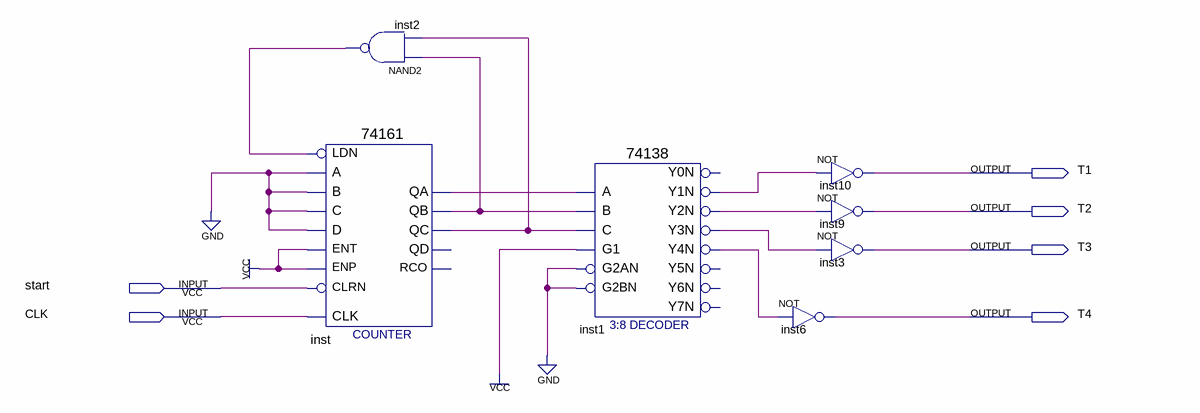
[diagram p0: schematic sheet]
// Quartus schematic MyTime.bdf as structural Verilog: 7 symbols, 6 pins
module MyTime (
  input  start,
  input  CLK,
  output T1,
  output T2,
  output T3,
  output T4
);

  wire inst1_y1n, inst1_y2n, inst1_y3n, inst1_y4n, inst2_out, inst_qa, inst_qb, inst_qc;

  \74161  inst (
    .CLRN(start), .CLK(CLK), .ENP(1'b1), .LDN(inst2_out), .A(1'b0), .D(1'b0), .ENT(1'b1), .B(1'b0), .C(1'b0),
    .QC(inst_qc), .QB(inst_qb), .QA(inst_qa));  // open: QD, RCO
  nand inst2 (inst2_out, inst_qb, inst_qc);
  \74138  inst1 (
    .A(inst_qa), .B(inst_qb), .G1(1'b1), .C(inst_qc), .G2AN(1'b0), .G2BN(1'b0), .Y1N(inst1_y1n),
    .Y2N(inst1_y2n), .Y3N(inst1_y3n), .Y4N(inst1_y4n));  // open: Y0N, Y5N, Y6N, Y7N
  not inst10 (T1, inst1_y1n);
  not inst9 (T2, inst1_y2n);
  not inst3 (T3, inst1_y3n);
  not inst6 (T4, inst1_y4n);
endmodule
